# Altium project Imge.PrjPcb
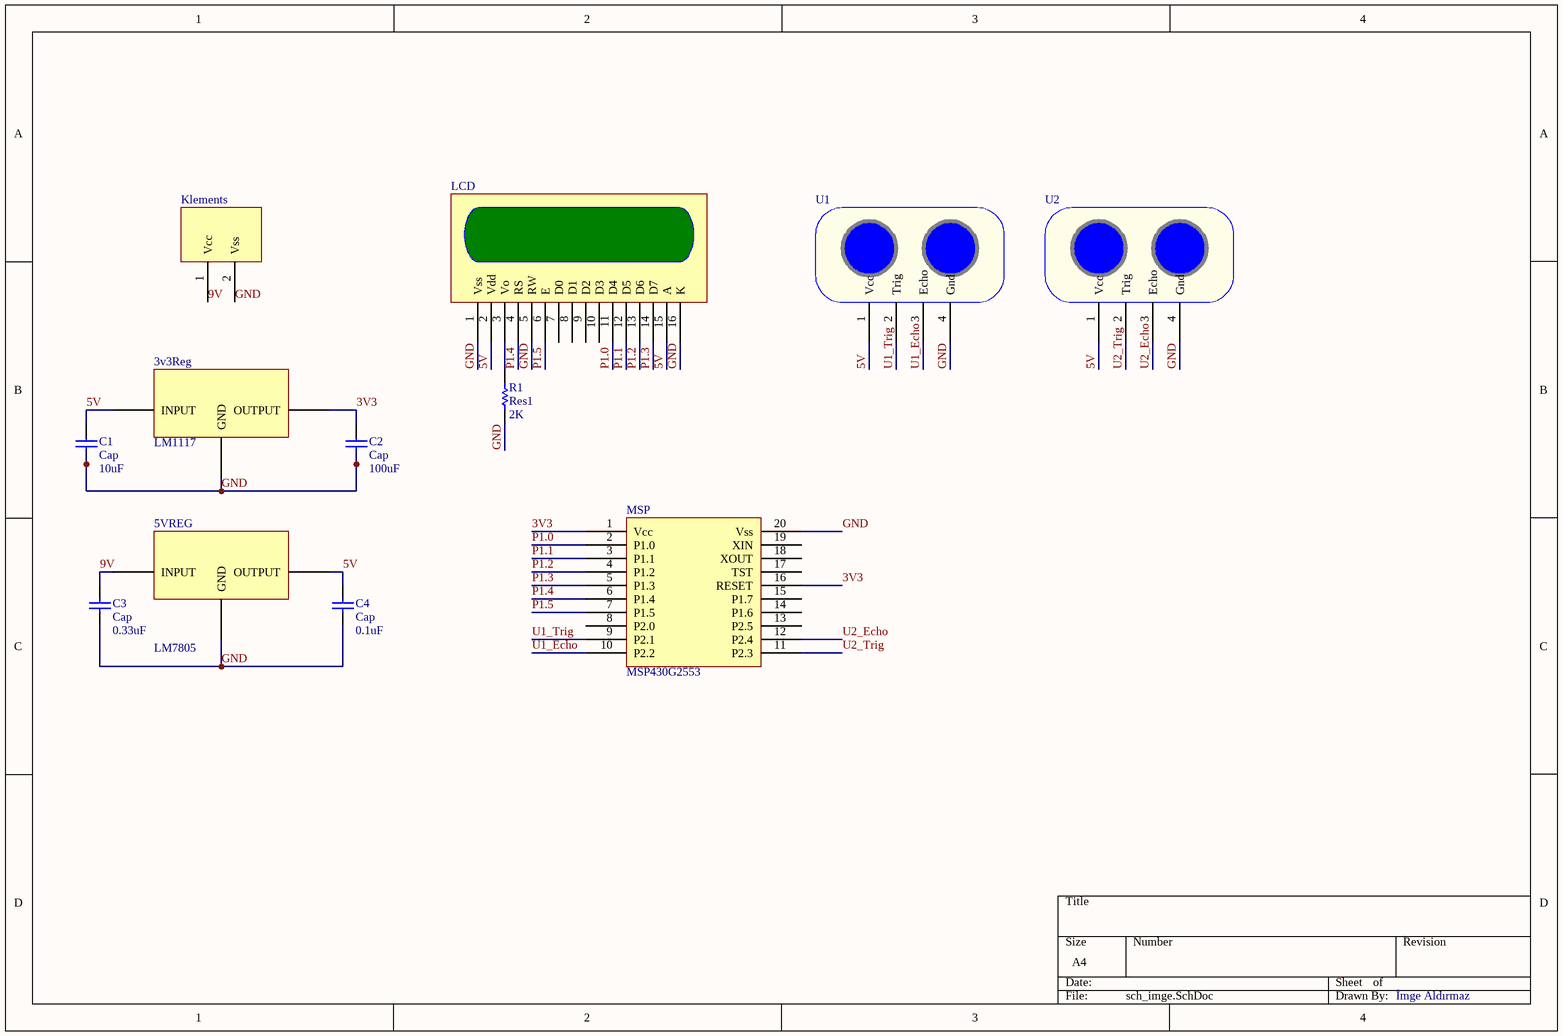
[diagram p0: sch_imge.SchDoc]
1 sheet, 12 parts. Net scope: global (net labels, ports and power ports of the same name join across sheets).
Board file: pcb_imge.PcbDoc

## Sheet sch_imge.SchDoc
size A4

### Parts
3v3Reg  LM1117  [3v3_Reg_]
5VREG  LM7805  [5V_REG]
C1  Cap  value 10uF  [RAD-0.3]
C2  Cap  value 100uF  [RAD-0.3]
C3  Cap  value 0.33uF  [RAD-0.3]
C4  Cap  value 0.1uF  [RAD-0.3]
K  Klements  [Klements]
LCD  LCD  [LCD]  (value not drawn)
MSP  MSP430G2553  [MSP430G2553_FP]
R1  Res1  value 2K  [AXIAL-0.3]
U1  Ultrasonic  [Ultasonik_FP]  (value not drawn)
U2  Ultrasonic  [Ultasonik_FP]  (value not drawn)

### Nets
3V3: 3v3Reg.1(OUTPUT) C2.2 MSP.1(Vcc) MSP.16(RESET)
5V: 3v3Reg.2(INPUT) 5VREG.2(OUTPUT) C1.2 C4.2 LCD.2(Vdd) LCD.15(A) U1.1(Vcc) U2.1(Vcc)
9V: 5VREG.0(INPUT) C3.2 K.1(Vcc)
GND: 3v3Reg.0(GND) 5VREG.1(GND) C1.1 C2.1 C3.1 C4.1 K.2(Vss) LCD.1(Vss) LCD.5(RW) LCD.16(K) MSP.20(Vss) R1.1 U1.4(Gnd) U2.4(Gnd)
P1.0: LCD.11(D4) MSP.2(P1.0)
P1.1: LCD.12(D5) MSP.3(P1.1)
P1.2: LCD.13(D6) MSP.4(P1.2)
P1.3: LCD.14(D7) MSP.5(P1.3)
P1.4: LCD.4(RS) MSP.6(P1.4)
P1.5: LCD.6(E) MSP.7(P1.5)
U1_Echo: MSP.10(P2.2) U1.3(Echo)
U1_Trig: MSP.9(P2.1) U1.2(Trig)
U2_Echo: MSP.12(P2.4) U2.3(Echo)
U2_Trig: MSP.11(P2.3) U2.2(Trig)
NetLCD_3: LCD.3(Vo) R1.2

Not connected (* = marked no-connect by the designer): LCD 7(D0) 8(D1) 9(D2) 10(D3); MSP 8(P2.0) 13(P2.5) 14(P1.6) 15(P1.7) 17(TST) 18(XOUT) 19(XIN)

### Notes on the sheet
- İmge Aldırmaz

### Library data of the parts
C1-C4 = Cap: Capacitor; Published: 8-Jun-2000; LatestRevisionDate: 17-Jul-2002; LatestRevisionNote: Re-released for DXP Platform.; PackageReference: RAD-0.3; Publisher: Altium Limited; PackageDescription: Radial Cap, Thru-Hole; 2 Leads; 0.3 in Pin Spacing
R1 = Res1: Resistor; Published: 8-Jun-2000; LatestRevisionDate: 17-Jul-2002; LatestRevisionNote: Re-released for DXP Platform.; PackageReference: AXIAL-0.3; Publisher: Altium Limited; PackageDescription: Axial Device, Thru-Hole; 2 Leads; 0.3 in Pin Spacing